# Altium schematic sheet hv_psu_v100_MAIN.SchDoc
size A4; SheetNumber: 2; SheetTotal: 7
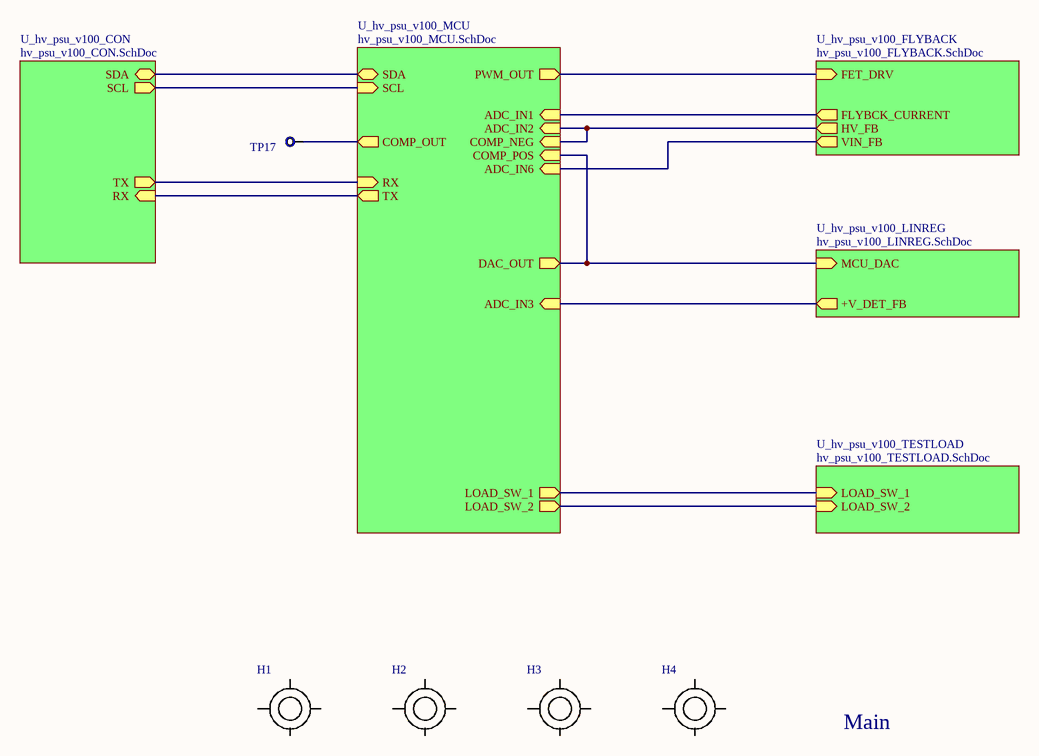
[diagram p0: hv_psu_v100_MAIN.SchDoc]

## Parts
H1  HOLE  [HOLE_140_160MIL]  (value not drawn)
H2  HOLE  [HOLE_140_160MIL]  (value not drawn)
H3  HOLE  [HOLE_140_160MIL]  (value not drawn)
H4  HOLE  [HOLE_140_160MIL]  (value not drawn)
TP17  ?  [PAD_40]  (value not drawn)  (no BOM)

## Sub-sheets
U_hv_psu_v100_CON = hv_psu_v100_CON.SchDoc: SDA (bidir), SCL (out), RX (in), TX (out)
U_hv_psu_v100_FLYBACK = hv_psu_v100_FLYBACK.SchDoc: FET_DRV (in), HV_FB (out), FLYBCK_CURRENT (out), VIN_FB (out)
U_hv_psu_v100_LINREG = hv_psu_v100_LINREG.SchDoc: MCU_DAC (in), +V_DET_FB (out)
U_hv_psu_v100_MCU = hv_psu_v100_MCU.SchDoc: SDA (bidir), SCL (in), ADC_IN1 (in), ADC_IN2 (in), COMP_NEG (in), ADC_IN3 (in), DAC_OUT (out), COMP_POS (in), PWM_OUT (out), LOAD_SW_1 (out), LOAD_SW_2 (out), COMP_OUT (out), ADC_IN6 (in), RX (in), TX (out)
U_hv_psu_v100_TESTLOAD = hv_psu_v100_TESTLOAD.SchDoc: LOAD_SW_1 (in), LOAD_SW_2 (in)

## Nets
NetTP17_1: TP17.1 ; sheet U_hv_psu_v100_MCU/COMP_OUT
(unnamed): sheet U_hv_psu_v100_FLYBACK/FET_DRV, sheet U_hv_psu_v100_MCU/PWM_OUT
(unnamed): sheet U_hv_psu_v100_FLYBACK/HV_FB, sheet U_hv_psu_v100_MCU/ADC_IN2, sheet U_hv_psu_v100_MCU/COMP_NEG
(unnamed): sheet U_hv_psu_v100_FLYBACK/FLYBCK_CURRENT, sheet U_hv_psu_v100_MCU/ADC_IN1
(unnamed): sheet U_hv_psu_v100_FLYBACK/VIN_FB, sheet U_hv_psu_v100_MCU/ADC_IN6
(unnamed): sheet U_hv_psu_v100_LINREG/MCU_DAC, sheet U_hv_psu_v100_MCU/DAC_OUT, sheet U_hv_psu_v100_MCU/COMP_POS
(unnamed): sheet U_hv_psu_v100_LINREG/+V_DET_FB, sheet U_hv_psu_v100_MCU/ADC_IN3
(unnamed): sheet U_hv_psu_v100_MCU/SDA, sheet U_hv_psu_v100_CON/SDA
(unnamed): sheet U_hv_psu_v100_MCU/SCL, sheet U_hv_psu_v100_CON/SCL
(unnamed): sheet U_hv_psu_v100_MCU/LOAD_SW_1, sheet U_hv_psu_v100_TESTLOAD/LOAD_SW_1
(unnamed): sheet U_hv_psu_v100_MCU/LOAD_SW_2, sheet U_hv_psu_v100_TESTLOAD/LOAD_SW_2
(unnamed): sheet U_hv_psu_v100_MCU/RX, sheet U_hv_psu_v100_CON/TX
(unnamed): sheet U_hv_psu_v100_MCU/TX, sheet U_hv_psu_v100_CON/RX

## Notes on the sheet
- Main

## Library data of the parts
TP17 = TESTPOINT